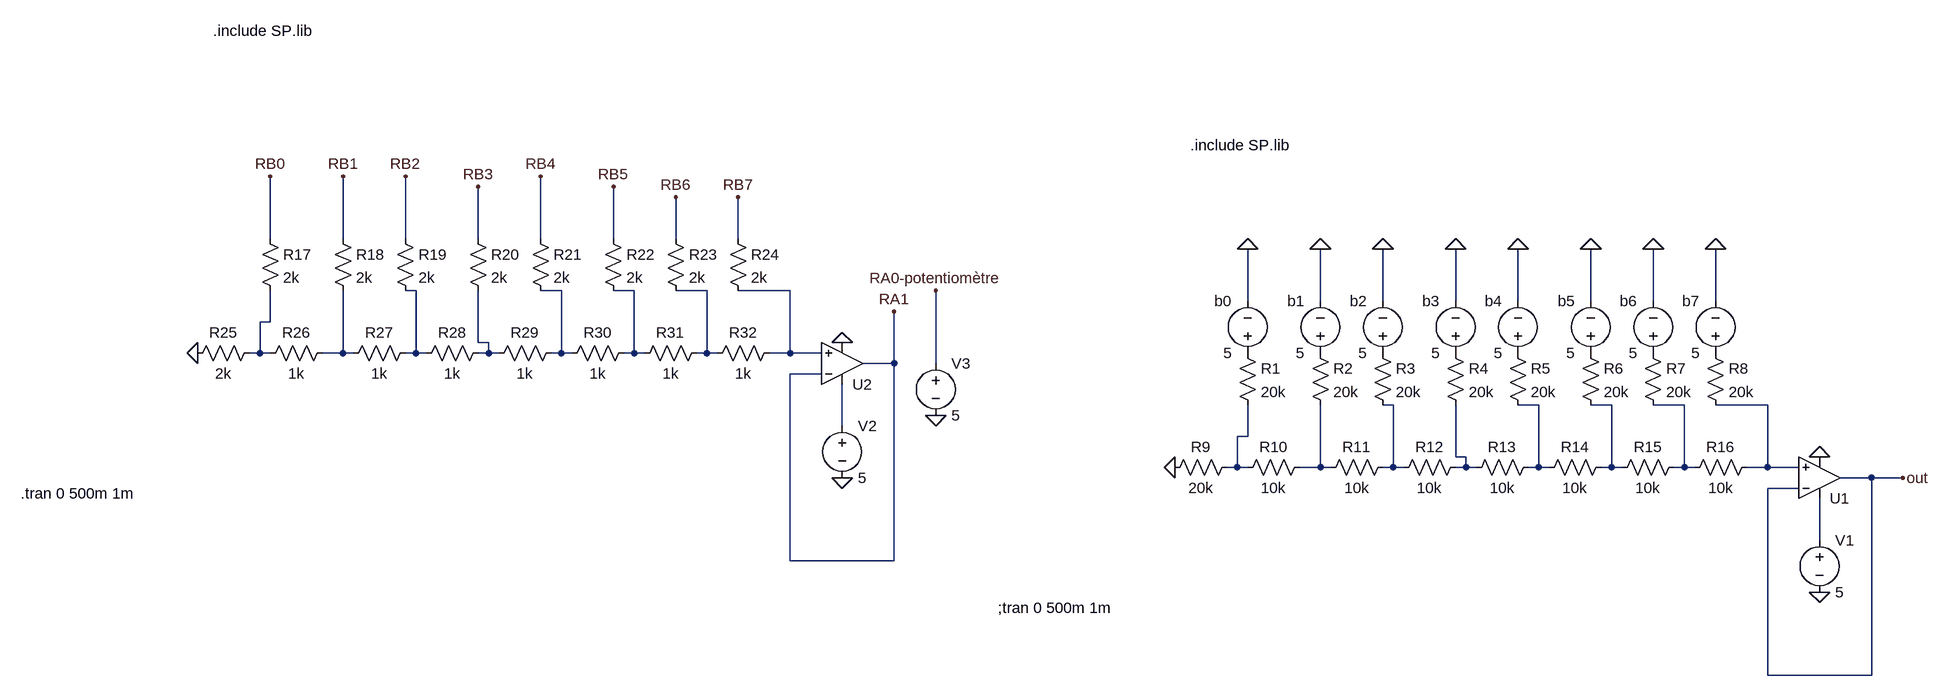
[diagram p0: schematic schemaDAC8bit.asc]
schemaDAC8bit.asc, the LTspice schematic file:
Version 4
SHEET 1 1160 680
WIRE -1408 -64 -1408 -160
WIRE -1296 -64 -1296 -160
WIRE -1200 -64 -1200 -160
WIRE -1088 -64 -1088 -144
WIRE -992 -64 -992 -160
WIRE -880 -64 -880 -144
WIRE -784 -64 -784 -128
WIRE -688 -64 -688 -128
WIRE -1184 16 -1200 16
WIRE -960 16 -992 16
WIRE -848 16 -880 16
WIRE -736 16 -784 16
WIRE -608 16 -688 16
WIRE 96 32 96 -48
WIRE 208 32 208 -48
WIRE 304 32 304 -48
WIRE 416 32 416 -48
WIRE 512 32 512 -48
WIRE 624 32 624 -48
WIRE 720 32 720 -48
WIRE 816 32 816 -48
WIRE -1408 64 -1408 16
WIRE -1408 64 -1424 64
WIRE -1088 96 -1088 16
WIRE -1072 96 -1088 96
WIRE -1424 112 -1424 64
WIRE -1424 112 -1440 112
WIRE -1408 112 -1424 112
WIRE -1296 112 -1296 16
WIRE -1296 112 -1328 112
WIRE -1280 112 -1296 112
WIRE -1184 112 -1184 16
WIRE -1184 112 -1200 112
WIRE -1168 112 -1184 112
WIRE -1072 112 -1072 96
WIRE -1072 112 -1088 112
WIRE -1056 112 -1072 112
WIRE -960 112 -960 16
WIRE -960 112 -976 112
WIRE -944 112 -960 112
WIRE -848 112 -848 16
WIRE -848 112 -864 112
WIRE -832 112 -848 112
WIRE -736 112 -736 16
WIRE -736 112 -752 112
WIRE -720 112 -736 112
WIRE -608 112 -608 16
WIRE -608 112 -640 112
WIRE -560 112 -608 112
WIRE -448 128 -448 48
WIRE -448 128 -496 128
WIRE -384 128 -384 16
WIRE -560 144 -608 144
WIRE 320 192 304 192
WIRE 544 192 512 192
WIRE 656 192 624 192
WIRE 768 192 720 192
WIRE 896 192 816 192
WIRE -528 224 -528 160
WIRE 96 240 96 192
WIRE 96 240 80 240
WIRE 416 272 416 192
WIRE 432 272 416 272
WIRE 80 288 80 240
WIRE 80 288 64 288
WIRE 96 288 80 288
WIRE 208 288 208 192
WIRE 208 288 176 288
WIRE 224 288 208 288
WIRE 320 288 320 192
WIRE 320 288 304 288
WIRE 336 288 320 288
WIRE 432 288 432 272
WIRE 432 288 416 288
WIRE 448 288 432 288
WIRE 544 288 544 192
WIRE 544 288 528 288
WIRE 560 288 544 288
WIRE 656 288 656 192
WIRE 656 288 640 288
WIRE 672 288 656 288
WIRE 768 288 768 192
WIRE 768 288 752 288
WIRE 784 288 768 288
WIRE 896 288 896 192
WIRE 896 288 864 288
WIRE 944 288 896 288
WIRE 1056 304 1008 304
WIRE 1104 304 1056 304
WIRE 944 320 896 320
WIRE 976 400 976 336
WIRE -608 432 -608 144
WIRE -448 432 -448 128
WIRE -448 432 -608 432
WIRE 896 608 896 320
WIRE 1056 608 1056 304
WIRE 1056 608 896 608
FLAG 96 -48 0
FLAG 208 -48 0
FLAG 304 -48 0
FLAG 416 -48 0
FLAG 512 -48 0
FLAG 624 -48 0
FLAG 720 -48 0
FLAG 816 -48 0
FLAG -16 288 0
FLAG 976 272 0
FLAG 976 480 0
FLAG 1104 304 out
FLAG -1520 112 0
FLAG -528 96 0
FLAG -528 304 0
FLAG -384 16 RA0-potentiomètre
FLAG -1408 -160 RB0
FLAG -1296 -160 RB1
FLAG -1200 -160 RB2
FLAG -1088 -144 RB3
FLAG -992 -160 RB4
FLAG -880 -144 RB5
FLAG -784 -128 RB6
FLAG -688 -128 RB7
FLAG -384 208 0
FLAG -448 48 RA1
SYMBOL res 80 96 R0
SYMATTR InstName R1
SYMATTR Value 20k
SYMBOL res 192 96 R0
SYMATTR InstName R2
SYMATTR Value 20k
SYMBOL res 288 96 R0
SYMATTR InstName R3
SYMATTR Value 20k
SYMBOL res 400 96 R0
SYMATTR InstName R4
SYMATTR Value 20k
SYMBOL res 496 96 R0
SYMATTR InstName R5
SYMATTR Value 20k
SYMBOL res 608 96 R0
SYMATTR InstName R6
SYMATTR Value 20k
SYMBOL res 704 96 R0
SYMATTR InstName R7
SYMATTR Value 20k
SYMBOL res 800 96 R0
SYMATTR InstName R8
SYMATTR Value 20k
SYMBOL res 80 272 R90
WINDOW 0 0 56 VBottom 2
WINDOW 3 32 56 VTop 2
SYMATTR InstName R9
SYMATTR Value 20k
SYMBOL res 192 272 R90
WINDOW 0 0 56 VBottom 2
WINDOW 3 32 56 VTop 2
SYMATTR InstName R10
SYMATTR Value 10k
SYMBOL res 320 272 R90
WINDOW 0 0 56 VBottom 2
WINDOW 3 32 56 VTop 2
SYMATTR InstName R11
SYMATTR Value 10k
SYMBOL res 432 272 R90
WINDOW 0 0 56 VBottom 2
WINDOW 3 32 56 VTop 2
SYMATTR InstName R12
SYMATTR Value 10k
SYMBOL res 544 272 R90
WINDOW 0 0 56 VBottom 2
WINDOW 3 32 56 VTop 2
SYMATTR InstName R13
SYMATTR Value 10k
SYMBOL res 656 272 R90
WINDOW 0 0 56 VBottom 2
WINDOW 3 32 56 VTop 2
SYMATTR InstName R14
SYMATTR Value 10k
SYMBOL res 768 272 R90
WINDOW 0 0 56 VBottom 2
WINDOW 3 32 56 VTop 2
SYMATTR InstName R15
SYMATTR Value 10k
SYMBOL res 880 272 R90
WINDOW 0 0 56 VBottom 2
WINDOW 3 32 56 VTop 2
SYMATTR InstName R16
SYMATTR Value 10k
SYMBOL voltage 96 128 R180
WINDOW 0 24 96 Left 2
WINDOW 3 24 16 Left 2
WINDOW 123 0 0 Left 0
WINDOW 39 0 0 Left 0
SYMATTR InstName b0
SYMATTR Value 5
SYMBOL voltage 208 128 R180
WINDOW 0 24 96 Left 2
WINDOW 3 24 16 Left 2
WINDOW 123 0 0 Left 0
WINDOW 39 0 0 Left 0
SYMATTR InstName b1
SYMATTR Value 5
SYMBOL voltage 304 128 R180
WINDOW 0 24 96 Left 2
WINDOW 3 24 16 Left 2
WINDOW 123 0 0 Left 0
WINDOW 39 0 0 Left 0
SYMATTR InstName b2
SYMATTR Value 5
SYMBOL voltage 416 128 R180
WINDOW 0 24 96 Left 2
WINDOW 3 24 16 Left 2
WINDOW 123 0 0 Left 0
WINDOW 39 0 0 Left 0
SYMATTR InstName b3
SYMATTR Value 5
SYMBOL voltage 512 128 R180
WINDOW 0 24 96 Left 2
WINDOW 3 24 16 Left 2
WINDOW 123 0 0 Left 0
WINDOW 39 0 0 Left 0
SYMATTR InstName b4
SYMATTR Value 5
SYMBOL voltage 624 128 R180
WINDOW 0 24 96 Left 2
WINDOW 3 24 16 Left 2
WINDOW 123 0 0 Left 0
WINDOW 39 0 0 Left 0
SYMATTR InstName b5
SYMATTR Value 5
SYMBOL voltage 720 128 R180
WINDOW 0 24 96 Left 2
WINDOW 3 24 16 Left 2
WINDOW 123 0 0 Left 0
WINDOW 39 0 0 Left 0
SYMATTR InstName b6
SYMATTR Value 5
SYMBOL voltage 816 128 R180
WINDOW 0 24 96 Left 2
WINDOW 3 24 16 Left 2
WINDOW 123 0 0 Left 0
WINDOW 39 0 0 Left 0
SYMATTR InstName b7
SYMATTR Value 5
SYMBOL OpAmps\\UniversalOpamp2 976 304 M180
SYMATTR InstName U1
SYMBOL voltage 976 384 R0
WINDOW 123 0 0 Left 0
WINDOW 39 0 0 Left 0
SYMATTR InstName V1
SYMATTR Value 5
SYMBOL res -1424 -80 R0
SYMATTR InstName R17
SYMATTR Value 2k
SYMBOL res -1312 -80 R0
SYMATTR InstName R18
SYMATTR Value 2k
SYMBOL res -1216 -80 R0
SYMATTR InstName R19
SYMATTR Value 2k
SYMBOL res -1104 -80 R0
SYMATTR InstName R20
SYMATTR Value 2k
SYMBOL res -1008 -80 R0
SYMATTR InstName R21
SYMATTR Value 2k
SYMBOL res -896 -80 R0
SYMATTR InstName R22
SYMATTR Value 2k
SYMBOL res -800 -80 R0
SYMATTR InstName R23
SYMATTR Value 2k
SYMBOL res -704 -80 R0
SYMATTR InstName R24
SYMATTR Value 2k
SYMBOL res -1424 96 R90
WINDOW 0 0 56 VBottom 2
WINDOW 3 32 56 VTop 2
SYMATTR InstName R25
SYMATTR Value 2k
SYMBOL res -1312 96 R90
WINDOW 0 0 56 VBottom 2
WINDOW 3 32 56 VTop 2
SYMATTR InstName R26
SYMATTR Value 1k
SYMBOL res -1184 96 R90
WINDOW 0 0 56 VBottom 2
WINDOW 3 32 56 VTop 2
SYMATTR InstName R27
SYMATTR Value 1k
SYMBOL res -1072 96 R90
WINDOW 0 0 56 VBottom 2
WINDOW 3 32 56 VTop 2
SYMATTR InstName R28
SYMATTR Value 1k
SYMBOL res -960 96 R90
WINDOW 0 0 56 VBottom 2
WINDOW 3 32 56 VTop 2
SYMATTR InstName R29
SYMATTR Value 1k
SYMBOL res -848 96 R90
WINDOW 0 0 56 VBottom 2
WINDOW 3 32 56 VTop 2
SYMATTR InstName R30
SYMATTR Value 1k
SYMBOL res -736 96 R90
WINDOW 0 0 56 VBottom 2
WINDOW 3 32 56 VTop 2
SYMATTR InstName R31
SYMATTR Value 1k
SYMBOL res -624 96 R90
WINDOW 0 0 56 VBottom 2
WINDOW 3 32 56 VTop 2
SYMATTR InstName R32
SYMATTR Value 1k
SYMBOL OpAmps\\UniversalOpamp2 -528 128 M180
SYMATTR InstName U2
SYMBOL voltage -528 208 R0
WINDOW 123 0 0 Left 0
WINDOW 39 0 0 Left 0
SYMATTR InstName V2
SYMATTR Value 5
SYMBOL voltage -384 112 R0
SYMATTR InstName V3
SYMATTR Value 5
TEXT 8 -208 Left 2 !.include SP.lib
TEXT -288 504 Left 2 !;tran 0 500m 1m
TEXT -1496 -384 Left 2 !.include SP.lib
TEXT -1792 328 Left 2 !.tran 0 500m 1m

The netlist it stands for:
* schemaDAC8bit.asc
R1 P001 N015 20k
R2 P002 N017 20k
R3 P003 N009 20k
R4 P004 N016 20k
R5 P005 N010 20k
R6 P006 N011 20k
R7 P007 N012 20k
R8 P008 N013 20k
R9 N015 0 20k
R10 N017 N015 10k
R11 N009 N017 10k
R12 N016 N009 10k
R13 N010 N016 10k
R14 N011 N010 10k
R15 N012 N011 10k
R16 N013 N012 10k
V§b0 P001 0 5
V§b1 P002 0 5
V§b2 P003 0 5
V§b3 P004 0 5
V§b4 P005 0 5
V§b5 P006 0 5
V§b6 P007 0 5
V§b7 P008 0 5
XU1 N013 out N018 0 out level.2 Avol=1Meg GBW=10Meg Slew=10Meg ilimit=25m rail=0 Vos=0 phimargin=45 en=0 enk=0 in=0 ink=0 Rin=500Meg  ; pins IN+ IN- V+ V- OUT
V1 N018 0 5
R17 RB0 N006 2k
R18 RB1 N008 2k
R19 RB2 N001 2k
R20 RB3 N007 2k
R21 RB4 N002 2k
R22 RB5 N003 2k
R23 RB6 N004 2k
R24 RB7 N005 2k
R25 N006 0 2k
R26 N008 N006 1k
R27 N001 N008 1k
R28 N007 N001 1k
R29 N002 N007 1k
R30 N003 N002 1k
R31 N004 N003 1k
R32 N005 N004 1k
XU2 N005 RA1 N014 0 RA1 level.2 Avol=1Meg GBW=10Meg Slew=10Meg ilimit=25m rail=0 Vos=0 phimargin=45 en=0 enk=0 in=0 ink=0 Rin=500Meg  ; pins IN+ IN- V+ V- OUT
V2 N014 0 5
V3 RA0-potentiomètre 0 5
.include SP.lib
;tran 0 500m 1m
.include SP.lib
.tran 0 500m 1m
.lib UniversalOpamps2.sub
.backanno
.end